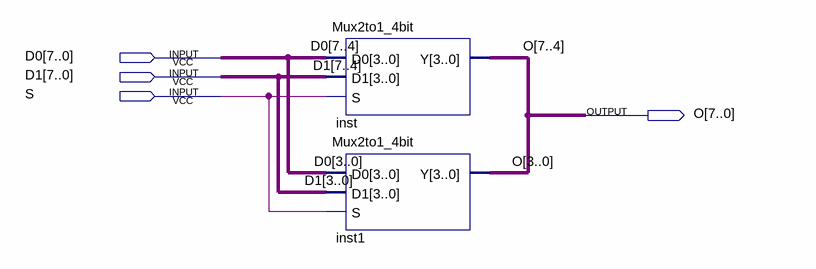
[diagram p0: schematic sheet]
// Quartus schematic Mux2to1_8bit.bdf as structural Verilog: 2 symbols, 4 pins
module Mux2to1_8bit (
  input  [7:0] D0,
  input  [7:0] D1,
  input  S,
  output [7:0] O
);

  Mux2to1_4bit inst (.D0(D0[7:4]), .D1(D1[7:4]), .S(S), .Y(O[7:4]));
  Mux2to1_4bit inst1 (.D0(D0[3:0]), .D1(D1[3:0]), .S(S), .Y(O[3:0]));
endmodule
